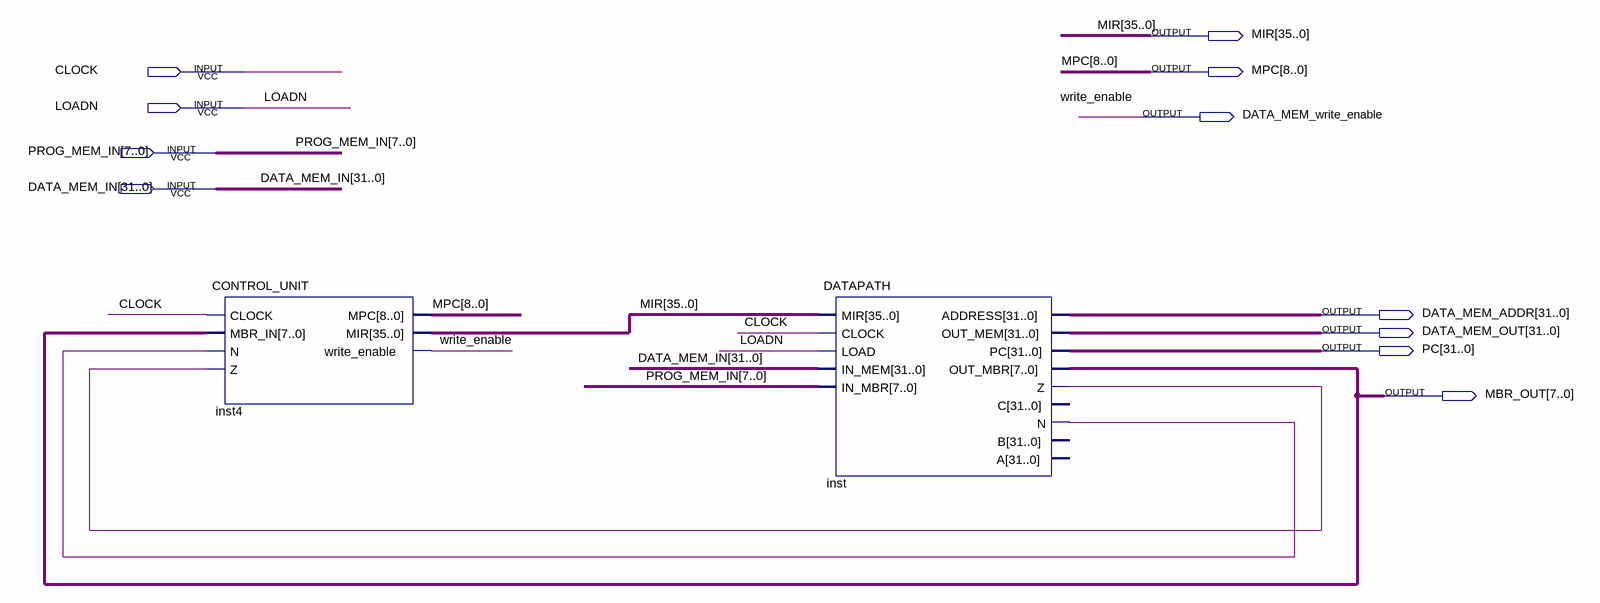
[diagram p0: schematic sheet]
// Quartus schematic CPU.bdf as structural Verilog: 2 symbols, 11 pins
module CPU (
  input  CLOCK,
  input  LOADN,
  input  [7:0] PROG_MEM_IN,
  input  [31:0] DATA_MEM_IN,
  output [35:0] MIR,
  output [8:0] MPC,
  output DATA_MEM_write_enable,
  output [31:0] DATA_MEM_ADDR,
  output [31:0] DATA_MEM_OUT,
  output [31:0] PC,
  output [7:0] MBR_OUT
);

  wire inst_n, inst_z;

  CONTROL_UNIT inst4 (
    .CLOCK(CLOCK), .MBR_IN(MBR_OUT), .N(inst_n), .Z(inst_z), .MPC(MPC), .MIR(MIR),
    .write_enable(DATA_MEM_write_enable));
  DATAPATH inst (
    .MIR(MIR), .CLOCK(CLOCK), .LOAD(LOADN), .IN_MEM(DATA_MEM_IN), .IN_MBR(PROG_MEM_IN),
    .ADDRESS(DATA_MEM_ADDR), .OUT_MEM(DATA_MEM_OUT), .PC(PC), .OUT_MBR(MBR_OUT), .Z(inst_z), .N(inst_n));  // open: C, B, A

  // Other names for the same wires on the sheet: write_enable = DATA_MEM_write_enable
endmodule
